# Altium schematic sheet DC309A_RXIN.SchDoc: RXIN
size 558 x 431 mm; Date: Not shown in title block; ApprovedBy: Not shown in title block; CheckedBy: Not shown in title block; Author: Not shown in title block; CompanyName: Not shown in title block; DrawnBy: KAVIKANNAN; Engineer: Not shown in title block; Organization: Not shown in title block; Address1: Not shown in title block; Address2: Not shown in title block; Address3: Not shown in title block; Address4: Not shown in title block; DocumentNumber: 3; Revision: Use project parameter SCH_Rev; SheetNumber: 3; SheetTotal: 11; PageSetup: Record=PageOptions|CenterHorizontal=True|CenterVertical=True|PrintScale=1.00|XCorrection=1.00|YCorrection=1.00|PrintKind=0|BorderSize=5000000|LeftOffset=0|BottomOffset=0|Orientation=2|PaperLength=1000|PaperWidth=1000|Scale=100|PaperSource=15|PrintQuality=600|MediaType=1|DitherType=10|PaperKind=Letter|PrintScaleMode=1; CurrentTime: Not shown in title block; CurrentDate: Not shown in title block; Time: Not shown in title block; DocumentFullPathAndName: Not shown in title block; DocumentName: Not shown in title block; ModifiedDate: Not shown in title block; ImagePath: Not shown in title block
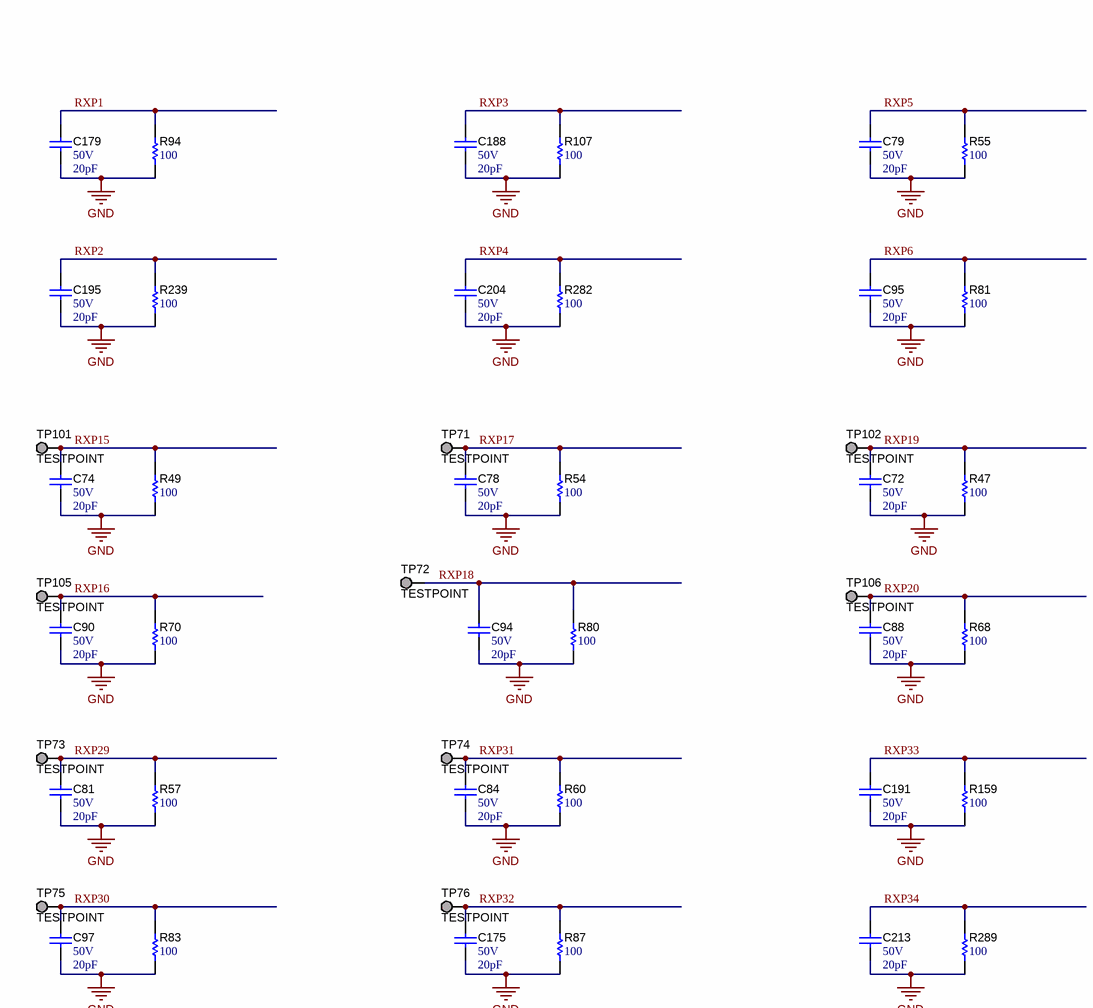
[diagram p0: DC309A_RXIN.SchDoc, top left]
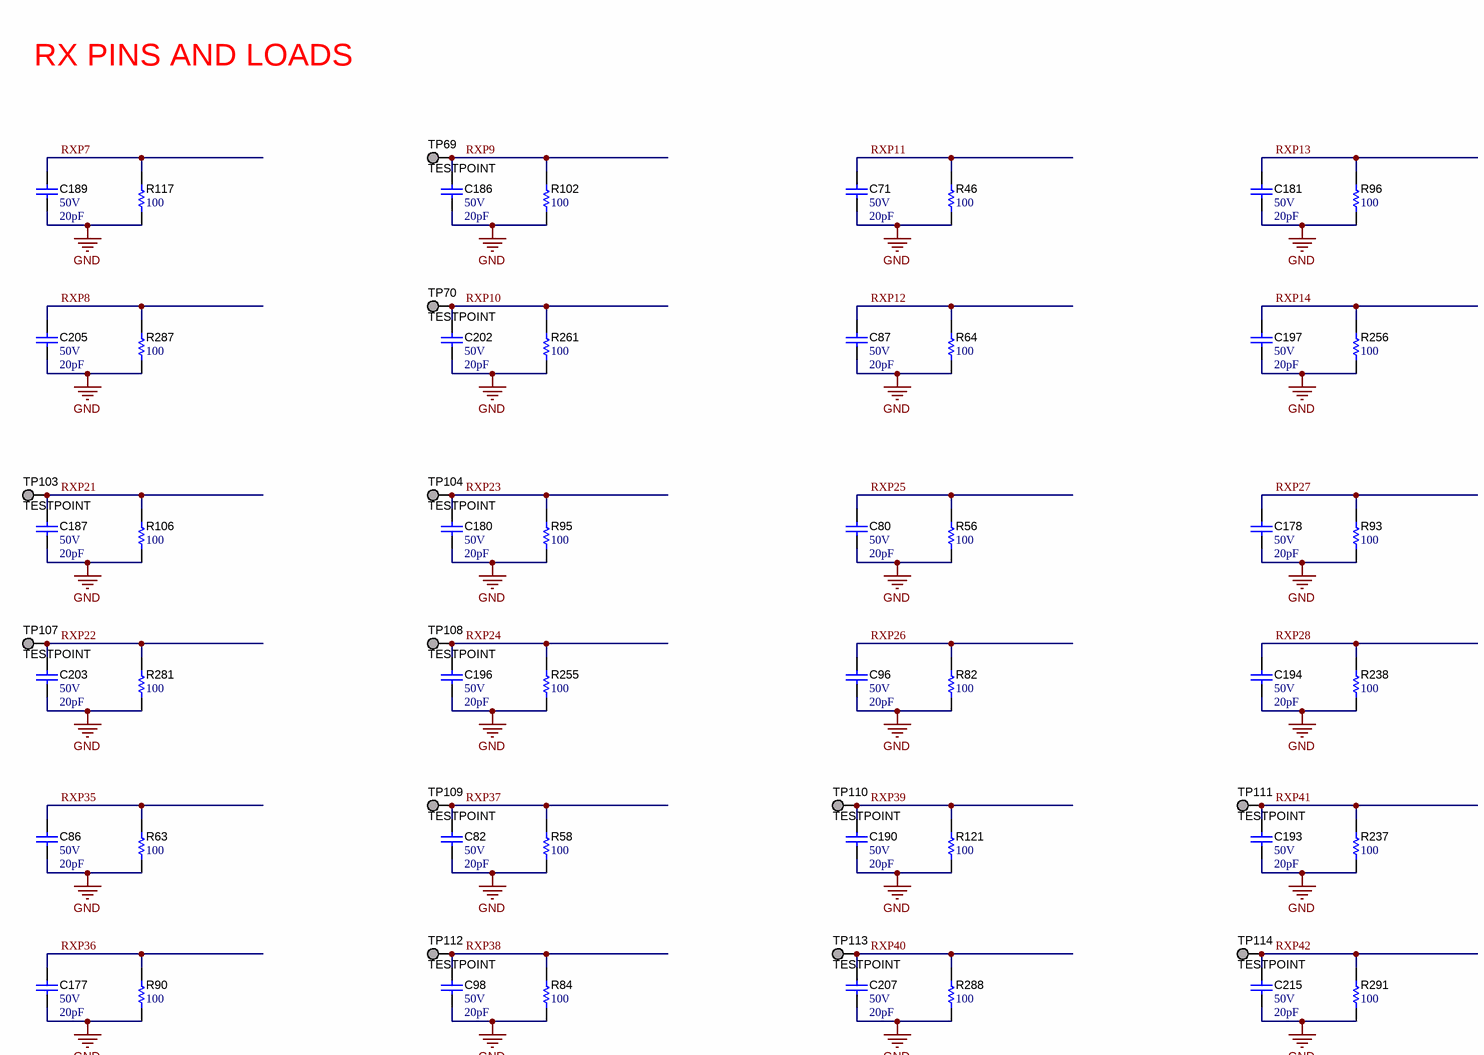
[diagram p1: DC309A_RXIN.SchDoc, top right]
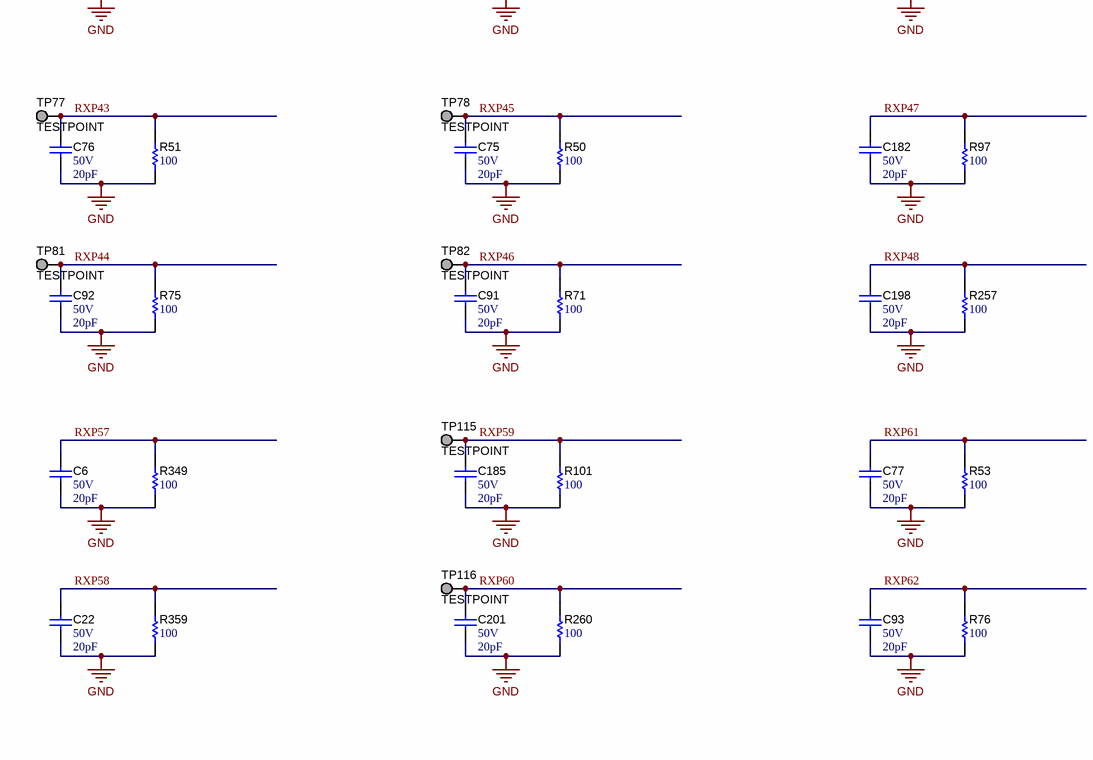
[diagram p2: DC309A_RXIN.SchDoc, bottom left]
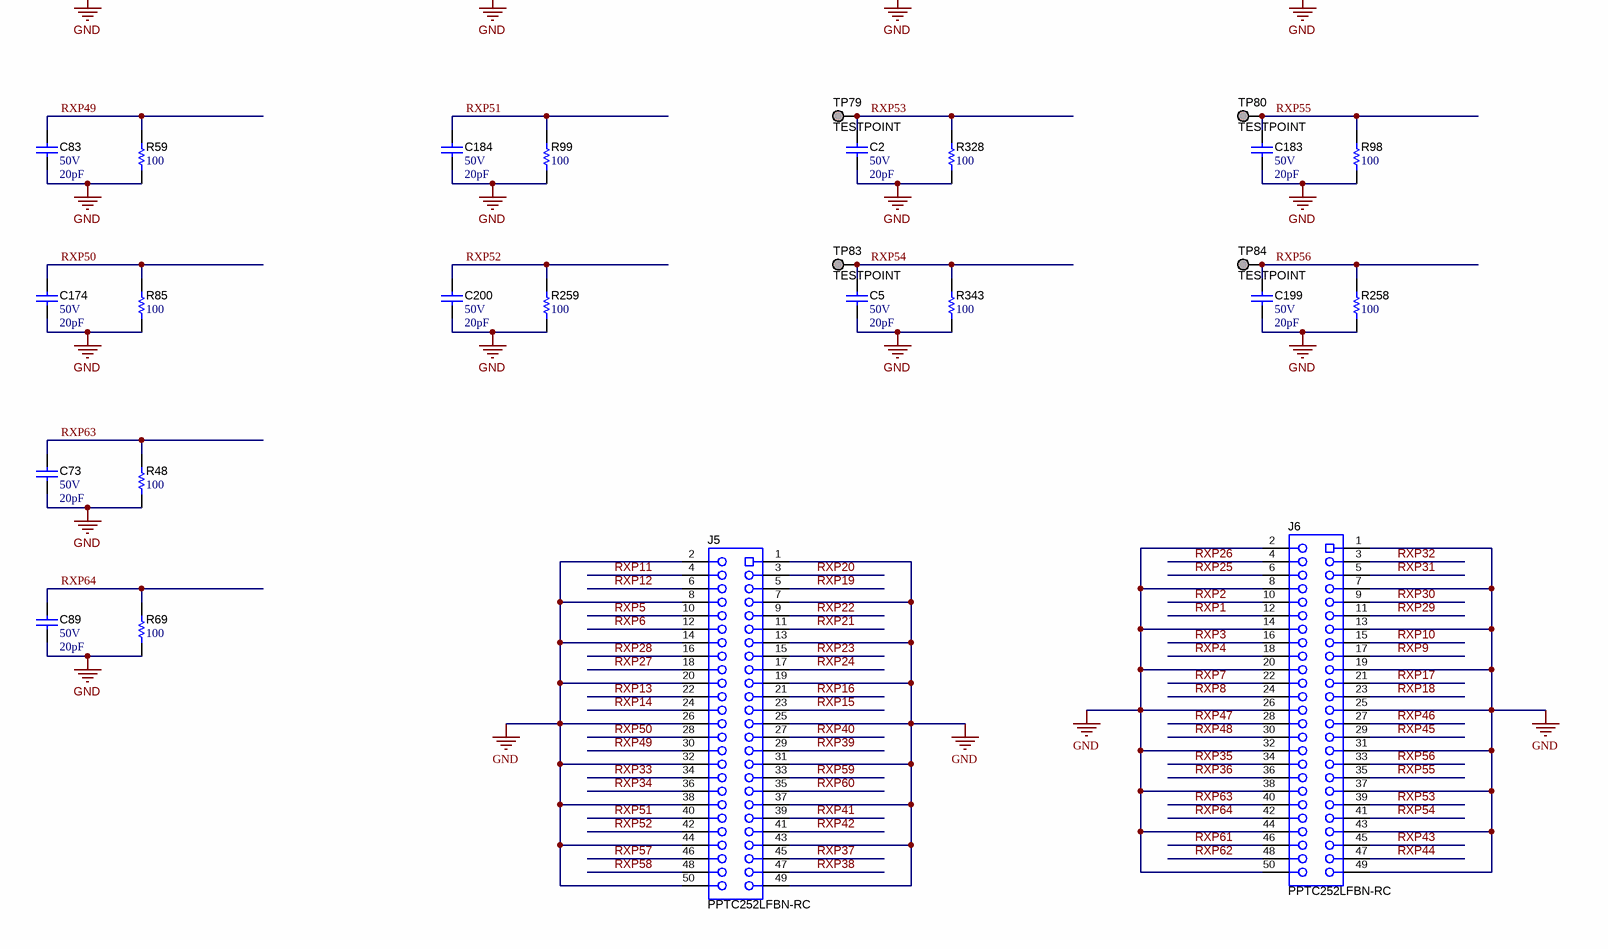
[diagram p3: DC309A_RXIN.SchDoc, bottom right]

## Parts
C2  VDC_V: 50V  ValueDisplayed: 20pF  [0402]  (hidden comment: C0402C200J5GACTU)
C5  VDC_V: 50V  ValueDisplayed: 20pF  [0402]  (hidden comment: C0402C200J5GACTU)
C6  VDC_V: 50V  ValueDisplayed: 20pF  [0402]  (hidden comment: C0402C200J5GACTU)
C22  VDC_V: 50V  ValueDisplayed: 20pF  [0402]  (hidden comment: C0402C200J5GACTU)
C71  VDC_V: 50V  ValueDisplayed: 20pF  [0402]  (hidden comment: C0402C200J5GACTU)
C72  VDC_V: 50V  ValueDisplayed: 20pF  [0402]  (hidden comment: C0402C200J5GACTU)
C73  VDC_V: 50V  ValueDisplayed: 20pF  [0402]  (hidden comment: C0402C200J5GACTU)
C74  VDC_V: 50V  ValueDisplayed: 20pF  [0402]  (hidden comment: C0402C200J5GACTU)
C75  VDC_V: 50V  ValueDisplayed: 20pF  [0402]  (hidden comment: C0402C200J5GACTU)
C76  VDC_V: 50V  ValueDisplayed: 20pF  [0402]  (hidden comment: C0402C200J5GACTU)
C77  VDC_V: 50V  ValueDisplayed: 20pF  [0402]  (hidden comment: C0402C200J5GACTU)
C78  VDC_V: 50V  ValueDisplayed: 20pF  [0402]  (hidden comment: C0402C200J5GACTU)
C79  VDC_V: 50V  ValueDisplayed: 20pF  [0402]  (hidden comment: C0402C200J5GACTU)
C80  VDC_V: 50V  ValueDisplayed: 20pF  [0402]  (hidden comment: C0402C200J5GACTU)
C81  VDC_V: 50V  ValueDisplayed: 20pF  [0402]  (hidden comment: C0402C200J5GACTU)
C82  VDC_V: 50V  ValueDisplayed: 20pF  [0402]  (hidden comment: C0402C200J5GACTU)
C83  VDC_V: 50V  ValueDisplayed: 20pF  [0402]  (hidden comment: C0402C200J5GACTU)
C84  VDC_V: 50V  ValueDisplayed: 20pF  [0402]  (hidden comment: C0402C200J5GACTU)
C86  VDC_V: 50V  ValueDisplayed: 20pF  [0402]  (hidden comment: C0402C200J5GACTU)
C87  VDC_V: 50V  ValueDisplayed: 20pF  [0402]  (hidden comment: C0402C200J5GACTU)
C88  VDC_V: 50V  ValueDisplayed: 20pF  [0402]  (hidden comment: C0402C200J5GACTU)
C89  VDC_V: 50V  ValueDisplayed: 20pF  [0402]  (hidden comment: C0402C200J5GACTU)
C90  VDC_V: 50V  ValueDisplayed: 20pF  [0402]  (hidden comment: C0402C200J5GACTU)
C91  VDC_V: 50V  ValueDisplayed: 20pF  [0402]  (hidden comment: C0402C200J5GACTU)
C92  VDC_V: 50V  ValueDisplayed: 20pF  [0402]  (hidden comment: C0402C200J5GACTU)
C93  VDC_V: 50V  ValueDisplayed: 20pF  [0402]  (hidden comment: C0402C200J5GACTU)
C94  VDC_V: 50V  ValueDisplayed: 20pF  [0402]  (hidden comment: C0402C200J5GACTU)
C95  VDC_V: 50V  ValueDisplayed: 20pF  [0402]  (hidden comment: C0402C200J5GACTU)
C96  VDC_V: 50V  ValueDisplayed: 20pF  [0402]  (hidden comment: C0402C200J5GACTU)
C97  VDC_V: 50V  ValueDisplayed: 20pF  [0402]  (hidden comment: C0402C200J5GACTU)
C98  VDC_V: 50V  ValueDisplayed: 20pF  [0402]  (hidden comment: C0402C200J5GACTU)
C174  VDC_V: 50V  ValueDisplayed: 20pF  [0402]  (hidden comment: C0402C200J5GACTU)
C175  VDC_V: 50V  ValueDisplayed: 20pF  [0402]  (hidden comment: C0402C200J5GACTU)
C177  VDC_V: 50V  ValueDisplayed: 20pF  [0402]  (hidden comment: C0402C200J5GACTU)
C178  VDC_V: 50V  ValueDisplayed: 20pF  [0402]  (hidden comment: C0402C200J5GACTU)
C179  VDC_V: 50V  ValueDisplayed: 20pF  [0402]  (hidden comment: C0402C200J5GACTU)
C180  VDC_V: 50V  ValueDisplayed: 20pF  [0402]  (hidden comment: C0402C200J5GACTU)
C181  VDC_V: 50V  ValueDisplayed: 20pF  [0402]  (hidden comment: C0402C200J5GACTU)
C182  VDC_V: 50V  ValueDisplayed: 20pF  [0402]  (hidden comment: C0402C200J5GACTU)
C183  VDC_V: 50V  ValueDisplayed: 20pF  [0402]  (hidden comment: C0402C200J5GACTU)
C184  VDC_V: 50V  ValueDisplayed: 20pF  [0402]  (hidden comment: C0402C200J5GACTU)
C185  VDC_V: 50V  ValueDisplayed: 20pF  [0402]  (hidden comment: C0402C200J5GACTU)
C186  VDC_V: 50V  ValueDisplayed: 20pF  [0402]  (hidden comment: C0402C200J5GACTU)
C187  VDC_V: 50V  ValueDisplayed: 20pF  [0402]  (hidden comment: C0402C200J5GACTU)
C188  VDC_V: 50V  ValueDisplayed: 20pF  [0402]  (hidden comment: C0402C200J5GACTU)
C189  VDC_V: 50V  ValueDisplayed: 20pF  [0402]  (hidden comment: C0402C200J5GACTU)
C190  VDC_V: 50V  ValueDisplayed: 20pF  [0402]  (hidden comment: C0402C200J5GACTU)
C191  VDC_V: 50V  ValueDisplayed: 20pF  [0402]  (hidden comment: C0402C200J5GACTU)
C193  VDC_V: 50V  ValueDisplayed: 20pF  [0402]  (hidden comment: C0402C200J5GACTU)
C194  VDC_V: 50V  ValueDisplayed: 20pF  [0402]  (hidden comment: C0402C200J5GACTU)
C195  VDC_V: 50V  ValueDisplayed: 20pF  [0402]  (hidden comment: C0402C200J5GACTU)
C196  VDC_V: 50V  ValueDisplayed: 20pF  [0402]  (hidden comment: C0402C200J5GACTU)
C197  VDC_V: 50V  ValueDisplayed: 20pF  [0402]  (hidden comment: C0402C200J5GACTU)
C198  VDC_V: 50V  ValueDisplayed: 20pF  [0402]  (hidden comment: C0402C200J5GACTU)
C199  VDC_V: 50V  ValueDisplayed: 20pF  [0402]  (hidden comment: C0402C200J5GACTU)
C200  VDC_V: 50V  ValueDisplayed: 20pF  [0402]  (hidden comment: C0402C200J5GACTU)
C201  VDC_V: 50V  ValueDisplayed: 20pF  [0402]  (hidden comment: C0402C200J5GACTU)
C202  VDC_V: 50V  ValueDisplayed: 20pF  [0402]  (hidden comment: C0402C200J5GACTU)
C203  VDC_V: 50V  ValueDisplayed: 20pF  [0402]  (hidden comment: C0402C200J5GACTU)
C204  VDC_V: 50V  ValueDisplayed: 20pF  [0402]  (hidden comment: C0402C200J5GACTU)
C205  VDC_V: 50V  ValueDisplayed: 20pF  [0402]  (hidden comment: C0402C200J5GACTU)
C207  VDC_V: 50V  ValueDisplayed: 20pF  [0402]  (hidden comment: C0402C200J5GACTU)
C213  VDC_V: 50V  ValueDisplayed: 20pF  [0402]  (hidden comment: C0402C200J5GACTU)
C215  VDC_V: 50V  ValueDisplayed: 20pF  [0402]  (hidden comment: C0402C200J5GACTU)
J5  PPTC252LFBN-RC  [Sullins_xPxC252LFBN]
J6  PPTC252LFBN-RC  [Sullins_xPxC252LFBN]
R46  ValueDisplayed: 100  [0402]  (hidden comment: RG1005P-101-B-T5)
R47  ValueDisplayed: 100  [0402]  (hidden comment: RG1005P-101-B-T5)
R48  ValueDisplayed: 100  [0402]  (hidden comment: RG1005P-101-B-T5)
R49  ValueDisplayed: 100  [0402]  (hidden comment: RG1005P-101-B-T5)
R50  ValueDisplayed: 100  [0402]  (hidden comment: RG1005P-101-B-T5)
R51  ValueDisplayed: 100  [0402]  (hidden comment: RG1005P-101-B-T5)
R53  ValueDisplayed: 100  [0402]  (hidden comment: RG1005P-101-B-T5)
R54  ValueDisplayed: 100  [0402]  (hidden comment: RG1005P-101-B-T5)
R55  ValueDisplayed: 100  [0402]  (hidden comment: RG1005P-101-B-T5)
R56  ValueDisplayed: 100  [0402]  (hidden comment: RG1005P-101-B-T5)
R57  ValueDisplayed: 100  [0402]  (hidden comment: RG1005P-101-B-T5)
R58  ValueDisplayed: 100  [0402]  (hidden comment: RG1005P-101-B-T5)
R59  ValueDisplayed: 100  [0402]  (hidden comment: RG1005P-101-B-T5)
R60  ValueDisplayed: 100  [0402]  (hidden comment: RG1005P-101-B-T5)
R63  ValueDisplayed: 100  [0402]  (hidden comment: RG1005P-101-B-T5)
R64  ValueDisplayed: 100  [0402]  (hidden comment: RG1005P-101-B-T5)
R68  ValueDisplayed: 100  [0402]  (hidden comment: RG1005P-101-B-T5)
R69  ValueDisplayed: 100  [0402]  (hidden comment: RG1005P-101-B-T5)
R70  ValueDisplayed: 100  [0402]  (hidden comment: RG1005P-101-B-T5)
R71  ValueDisplayed: 100  [0402]  (hidden comment: RG1005P-101-B-T5)
R75  ValueDisplayed: 100  [0402]  (hidden comment: RG1005P-101-B-T5)
R76  ValueDisplayed: 100  [0402]  (hidden comment: RG1005P-101-B-T5)
R80  ValueDisplayed: 100  [0402]  (hidden comment: RG1005P-101-B-T5)
R81  ValueDisplayed: 100  [0402]  (hidden comment: RG1005P-101-B-T5)
R82  ValueDisplayed: 100  [0402]  (hidden comment: RG1005P-101-B-T5)
R83  ValueDisplayed: 100  [0402]  (hidden comment: RG1005P-101-B-T5)
R84  ValueDisplayed: 100  [0402]  (hidden comment: RG1005P-101-B-T5)
R85  ValueDisplayed: 100  [0402]  (hidden comment: RG1005P-101-B-T5)
R87  ValueDisplayed: 100  [0402]  (hidden comment: RG1005P-101-B-T5)
R90  ValueDisplayed: 100  [0402]  (hidden comment: RG1005P-101-B-T5)
R93  ValueDisplayed: 100  [0402]  (hidden comment: RG1005P-101-B-T5)
R94  ValueDisplayed: 100  [0402]  (hidden comment: RG1005P-101-B-T5)
R95  ValueDisplayed: 100  [0402]  (hidden comment: RG1005P-101-B-T5)
R96  ValueDisplayed: 100  [0402]  (hidden comment: RG1005P-101-B-T5)
R97  ValueDisplayed: 100  [0402]  (hidden comment: RG1005P-101-B-T5)
R98  ValueDisplayed: 100  [0402]  (hidden comment: RG1005P-101-B-T5)
R99  ValueDisplayed: 100  [0402]  (hidden comment: RG1005P-101-B-T5)
R101  ValueDisplayed: 100  [0402]  (hidden comment: RG1005P-101-B-T5)
R102  ValueDisplayed: 100  [0402]  (hidden comment: RG1005P-101-B-T5)
R106  ValueDisplayed: 100  [0402]  (hidden comment: RG1005P-101-B-T5)
R107  ValueDisplayed: 100  [0402]  (hidden comment: RG1005P-101-B-T5)
R117  ValueDisplayed: 100  [0402]  (hidden comment: RG1005P-101-B-T5)
R121  ValueDisplayed: 100  [0402]  (hidden comment: RG1005P-101-B-T5)
R159  ValueDisplayed: 100  [0402]  (hidden comment: RG1005P-101-B-T5)
R237  ValueDisplayed: 100  [0402]  (hidden comment: RG1005P-101-B-T5)
R238  ValueDisplayed: 100  [0402]  (hidden comment: RG1005P-101-B-T5)
R239  ValueDisplayed: 100  [0402]  (hidden comment: RG1005P-101-B-T5)
R255  ValueDisplayed: 100  [0402]  (hidden comment: RG1005P-101-B-T5)
R256  ValueDisplayed: 100  [0402]  (hidden comment: RG1005P-101-B-T5)
R257  ValueDisplayed: 100  [0402]  (hidden comment: RG1005P-101-B-T5)
R258  ValueDisplayed: 100  [0402]  (hidden comment: RG1005P-101-B-T5)
R259  ValueDisplayed: 100  [0402]  (hidden comment: RG1005P-101-B-T5)
R260  ValueDisplayed: 100  [0402]  (hidden comment: RG1005P-101-B-T5)
R261  ValueDisplayed: 100  [0402]  (hidden comment: RG1005P-101-B-T5)
R281  ValueDisplayed: 100  [0402]  (hidden comment: RG1005P-101-B-T5)
R282  ValueDisplayed: 100  [0402]  (hidden comment: RG1005P-101-B-T5)
R287  ValueDisplayed: 100  [0402]  (hidden comment: RG1005P-101-B-T5)
R288  ValueDisplayed: 100  [0402]  (hidden comment: RG1005P-101-B-T5)
R289  ValueDisplayed: 100  [0402]  (hidden comment: RG1005P-101-B-T5)
R291  ValueDisplayed: 100  [0402]  (hidden comment: RG1005P-101-B-T5)
R328  ValueDisplayed: 100  [0402]  (hidden comment: RG1005P-101-B-T5)
R343  ValueDisplayed: 100  [0402]  (hidden comment: RG1005P-101-B-T5)
R349  ValueDisplayed: 100  [0402]  (hidden comment: RG1005P-101-B-T5)
R359  ValueDisplayed: 100  [0402]  (hidden comment: RG1005P-101-B-T5)
TP69  TESTPOINT  [TP_50MIL-SMT]  (no BOM)
TP70  TESTPOINT  [TP_50MIL-SMT]  (no BOM)
TP71  TESTPOINT  [TP_50MIL-SMT]  (no BOM)
TP72  TESTPOINT  [TP_50MIL-SMT]  (no BOM)
TP73  TESTPOINT  [TP_50MIL-SMT]  (no BOM)
TP74  TESTPOINT  [TP_50MIL-SMT]  (no BOM)
TP75  TESTPOINT  [TP_50MIL-SMT]  (no BOM)
TP76  TESTPOINT  [TP_50MIL-SMT]  (no BOM)
TP77  TESTPOINT  [TP_50MIL-SMT]  (no BOM)
TP78  TESTPOINT  [TP_50MIL-SMT]  (no BOM)
TP79  TESTPOINT  [TP_50MIL-SMT]  (no BOM)
TP80  TESTPOINT  [TP_50MIL-SMT]  (no BOM)
TP81  TESTPOINT  [TP_50MIL-SMT]  (no BOM)
TP82  TESTPOINT  [TP_50MIL-SMT]  (no BOM)
TP83  TESTPOINT  [TP_50MIL-SMT]  (no BOM)
TP84  TESTPOINT  [TP_50MIL-SMT]  (no BOM)
TP101  TESTPOINT  [TP_50MIL-SMT]  (no BOM)
TP102  TESTPOINT  [TP_50MIL-SMT]  (no BOM)
TP103  TESTPOINT  [TP_50MIL-SMT]  (no BOM)
TP104  TESTPOINT  [TP_50MIL-SMT]  (no BOM)
TP105  TESTPOINT  [TP_50MIL-SMT]  (no BOM)
TP106  TESTPOINT  [TP_50MIL-SMT]  (no BOM)
TP107  TESTPOINT  [TP_50MIL-SMT]  (no BOM)
TP108  TESTPOINT  [TP_50MIL-SMT]  (no BOM)
TP109  TESTPOINT  [TP_50MIL-SMT]  (no BOM)
TP110  TESTPOINT  [TP_50MIL-SMT]  (no BOM)
TP111  TESTPOINT  [TP_50MIL-SMT]  (no BOM)
TP112  TESTPOINT  [TP_50MIL-SMT]  (no BOM)
TP113  TESTPOINT  [TP_50MIL-SMT]  (no BOM)
TP114  TESTPOINT  [TP_50MIL-SMT]  (no BOM)
TP115  TESTPOINT  [TP_50MIL-SMT]  (no BOM)
TP116  TESTPOINT  [TP_50MIL-SMT]  (no BOM)

## Nets
GND: C2.2 C5.2 C6.2 C22.2 C71.2 C72.2 C73.2 C74.2 C75.2 C76.2 C77.2 C78.2 C79.2 C80.2 C81.2 C82.2 C83.2 C84.2 C86.2 C87.2 C88.2 C89.2 C90.2 C91.2 C92.2 C93.2 C94.2 C95.2 C96.2 C97.2 C98.2 C174.2 C175.2 C177.2 C178.2 C179.2 C180.2 C181.2 C182.2 C183.2 C184.2 C185.2 C186.2 C187.2 C188.2 C189.2 C190.2 C191.2 C193.2 C194.2 C195.2 C196.2 C197.2 C198.2 C199.2 C200.2 C201.2 C202.2 C203.2 C204.2 C205.2 C207.2 C213.2 C215.2 J5.1 J5.2 J5.7 J5.8 J5.13 J5.14 J5.19 J5.20 J5.25 J5.26 J5.31 J5.32 J5.37 J5.38 J5.43 J5.44 J5.49 J5.50 J6.1 J6.2 J6.7 J6.8 J6.13 J6.14 J6.19 J6.20 J6.25 J6.26 J6.31 J6.32 J6.37 J6.38 J6.43 J6.44 J6.49 J6.50 R46.1 R47.1 R48.1 R49.1 R50.1 R51.1 R53.1 R54.1 R55.1 R56.1 R57.1 R58.1 R59.1 R60.1 R63.1 R64.1 R68.1 R69.1 R70.1 R71.1 R75.1 R76.1 R80.1 R81.1 R82.1 R83.1 R84.1 R85.1 R87.1 R90.1 R93.1 R94.1 R95.1 R96.1 R97.1 R98.1 R99.1 R101.1 R102.1 R106.1 R107.1 R117.1 R121.1 R159.1 R237.1 R238.1 R239.1 R255.1 R256.1 R257.1 R258.1 R259.1 R260.1 R261.1 R281.1 R282.1 R287.1 R288.1 R289.1 R291.1 R328.1 R343.1 R349.1 R359.1
RXP1: C179.1 J6.12 R94.2
RXP2: C195.1 J6.10 R239.2
RXP3: C188.1 J6.16 R107.2
RXP4: C204.1 J6.18 R282.2
RXP5: C79.1 J5.10 R55.2
RXP6: C95.1 J5.12 R81.2
RXP7: C189.1 J6.22 R117.2
RXP8: C205.1 J6.24 R287.2
RXP9: C186.1 J6.17 R102.2 TP69.1
RXP10: C202.1 J6.15 R261.2 TP70.1
RXP11: C71.1 J5.4 R46.2
RXP12: C87.1 J5.6 R64.2
RXP13: C181.1 J5.22 R96.2
RXP14: C197.1 J5.24 R256.2
RXP15: C74.1 J5.23 R49.2 TP101.1
RXP16: C90.1 J5.21 R70.2 TP105.1
RXP17: C78.1 J6.21 R54.2 TP71.1
RXP18: C94.1 J6.23 R80.2 TP72.1
RXP19: C72.1 J5.5 R47.2 TP102.1
RXP20: C88.1 J5.3 R68.2 TP106.1
RXP21: C187.1 J5.11 R106.2 TP103.1
RXP22: C203.1 J5.9 R281.2 TP107.1
RXP23: C180.1 J5.15 R95.2 TP104.1
RXP24: C196.1 J5.17 R255.2 TP108.1
RXP25: C80.1 J6.6 R56.2
RXP26: C96.1 J6.4 R82.2
RXP27: C178.1 J5.18 R93.2
RXP28: C194.1 J5.16 R238.2
RXP29: C81.1 J6.11 R57.2 TP73.1
RXP30: C97.1 J6.9 R83.2 TP75.1
RXP31: C84.1 J6.5 R60.2 TP74.1
RXP32: C175.1 J6.3 R87.2 TP76.1
RXP33: C191.1 J5.34 R159.2
RXP34: C213.1 J5.36 R289.2
RXP35: C86.1 J6.34 R63.2
RXP36: C177.1 J6.36 R90.2
RXP37: C82.1 J5.45 R58.2 TP109.1
RXP38: C98.1 J5.47 R84.2 TP112.1
RXP39: C190.1 J5.29 R121.2 TP110.1
RXP40: C207.1 J5.27 R288.2 TP113.1
RXP41: C193.1 J5.39 R237.2 TP111.1
RXP42: C215.1 J5.41 R291.2 TP114.1
RXP43: C76.1 J6.45 R51.2 TP77.1
RXP44: C92.1 J6.47 R75.2 TP81.1
RXP45: C75.1 J6.29 R50.2 TP78.1
RXP46: C91.1 J6.27 R71.2 TP82.1
RXP47: C182.1 J6.28 R97.2
RXP48: C198.1 J6.30 R257.2
RXP49: C83.1 J5.30 R59.2
RXP50: C174.1 J5.28 R85.2
RXP51: C184.1 J5.40 R99.2
RXP52: C200.1 J5.42 R259.2
RXP53: C2.1 J6.39 R328.2 TP79.1
RXP54: C5.1 J6.41 R343.2 TP83.1
RXP55: C183.1 J6.35 R98.2 TP80.1
RXP56: C199.1 J6.33 R258.2 TP84.1
RXP57: C6.1 J5.46 R349.2
RXP58: C22.1 J5.48 R359.2
RXP59: C185.1 J5.33 R101.2 TP115.1
RXP60: C201.1 J5.35 R260.2 TP116.1
RXP61: C77.1 J6.46 R53.2
RXP62: C93.1 J6.48 R76.2
RXP63: C73.1 J6.40 R48.2
RXP64: C89.1 J6.42 R69.2

## Notes on the sheet
- RX PINS AND LOADS
- Labels drawn without touching a wire or pin: \
- Drawn By:
- SVN Rev:
- Number:
- TID #:
- Orderable:
- Rev:
- Sheet Title:
- File:
- Project Title:
- Designed for:
- Assembly Variant:
- Mod. Date:
- Sheet:
- Size:
- of
- C
- http://www.ti.com
- Texas Instruments and/or its licensors do not warrant the accuracy or completeness of this specification or any information contained therein. Texas Instruments and/or its licensors do not warrant that this design will meet the specifications, will be suitable for your application or fit for any particular purpose, or will operate in an implementation. Texas Instruments and/or its licensors do not warrant that the design is production worthy. You should completely validate and test your design implementation to confirm the system functionality for your application.
- Engineer:
- Contact:
- © Texas Instruments

## Library data of the parts
C2 C5 C6 C22 C71-C84 C86-C98 C174 C175 C177-C191 C193-C205 C207 C213 C215 = CMP-0006241-2: CAP, CERM, 20 pF, 50 V, +/- 5%, C0G/NP0, 0402; Manufacturer: Kemet; TaMin_C: -55°C; Polarized: N; SizeAreaWB_mm2: 3; Value1: Unknown; U/M: EA; Value: 20pF; TaMax_C: 125°C; SizeZ_mm: 0.6; SizeX_mm: 1; SizeY_mm: 0.5; AEC Category: Q200; Supplier Part Number 2: 29T8938; Publisher: Texas Instruments; Supplier 2: Newark; Supplier Part Number 3: 80-C0402C200J5G; TempCo: C0G/NP0; Supplier 3: Mouser; Published: 2008-06-19; RoHS: Y; MountType: SMT; Supplier 1: Digi-Key; PackageReference: 0402; Tolerance_%: 5%; Cap_Case: 0402; Value2: 50V; SizeArea_mm2: 0.5; CompType: Capacitor; LatestRevisionDate: 2017-03-09; PartNumber: C0402C200J5GACTU; AEC Qualified: N; Cap_F: 20pF; ComponentLink1Description: Datasheet link; AEC Grade: N/A; Supplier Part Number 1: 399-7773-1-ND; Technology: Ceramic; ComponentLink1URL: http://www.kemet.com/docfinder?Partnumber=C0402C200J5GACTU
J5 J6 = CMP-0054672-1: Receptacle, 2.54mm, 25x2, Tin, TH; Manufacturer: Sullins Connector Solutions; CNHeader: FALSE; Current_A: 3A; Gender: Female; Voltage_V: 250V; CompType: Socket Strip; Row_Count: 2; RowSpacing_mm: 2.54; CT: TRUE; Cert_UL: Y; ComponentLink1URL: http://www.sullinscorp.com/drawings/78_P(N)PxCxxxLFBN-RC,_10492-H.pdf; Publisher: Texas Instruments; Color: Black; RoHS: Y; MountType: TH; Supplier 1: Digi-Key; PackageReference: Receptacle, 2.54mm, 25x2, TH; PinCount: 50; LatestRevisionDate: 26/05/2017; PartNumber: PPTC252LFBN-RC; Orientation: Vertical; ComponentLink1Description: Datasheet URL; Supplier Part Number 1: S7093-ND; Pitch_mm: 2.54; ContactFinish: Tin
R46-R51 R53-R60 R63 R64 R68-R71 R75 R76 R80-R85 R87 R90 R93-R99 R101 R102 R106 R107 R117 R121 R159 R237-R239 R255-R261 R281 R282 R287-R289 R291 R328 R343 R349 R359 = CMP-0026814-1: RES, 100, 0.1%, 0.063 W, 0402; Manufacturer: Susumu Co Ltd; Power_W: 63mW; TempCo: 25 ppm/C; Value_Code: 100R; U/M: EA; Value: 100; SizeX_mm: 1; SizeY_mm: 0.5; SizeZ_mm: 0.6; Value2: 0.063W; AEC Category: Q200; EIA_Code: E192; ComponentLink1URL: http://www.susumu-usa.com/pdf/RG_Data_Sheet.pdf; Supplier Part Number 2: 85K1457; Publisher: Texas Instruments; Supplier 2: Newark; Supplier Part Number 3: 754-RG1005P-101-B-T5; Supplier 3: Mouser; Published: 2008-06-26; RoHS: Y; Value1: 0.1%; MountType: SMT; Supplier 1: Digi-Key; PackageReference: 0402; Tolerance_%: 0.1%; Res_ohm: 100; SizeArea_mm2: 0.5; CompType: Resistor; LatestRevisionDate: 2017-03-09; PartNumber: RG1005P-101-B-T5; AEC Qualified: ?; ComponentLink1Description: Datasheet link; Supplier Part Number 1: RG10P100BCT-ND; Technology: Thin Film
TP69-TP84 TP101-TP116 = CMP-0078143-3: TEST POINT.  No entry in BOM.; PackageReference: N/A; CompType: Testpoint; Manufacturer: N/A; PartNumber: N/A; Library Reference: TESTPOINT